# Altium schematic sheet GSM Module.SchDoc
size 209 x 297 mm; Author: Мурашкин Д.В.; Address1: Address1; Address2: Address2; Address3: Address3; Address4: Address4; DocumentNumber: АБВГ.123456.001 Э3; Scale: 1:1; Letter1Column: Э; PartName: GSM Модуль; DocumentName: 2
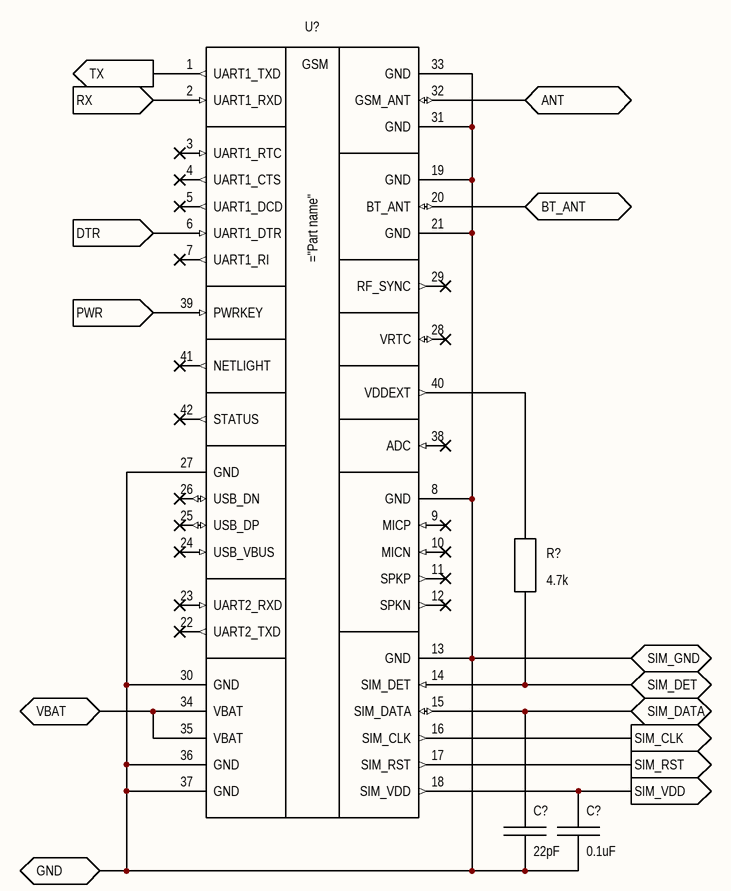
[diagram p0: GSM Module.SchDoc]

## Parts
(Parts that share a designator on the sheet are numbered #1, #2 ... from top to bottom, then left to right.)
C?#1  22pF  [CAPC1608L]
C?#2  0.1uF  [CAPC1608L]
R?  4.7k  [RESC1608L]
U?  (no value)  [SIM800C]

## Ports
ANT, BT_ANT, DTR (in), GND, PWR (in), RX (in), SIM_CLK (out), SIM_DATA (bidir), SIM_DET (bidir), SIM_GND, SIM_RST (out), SIM_VDD (out), TX (out), VBAT

## Nets
ANT: U?.32(GSM_ANT) ; port ANT
BT_ANT: U?.20(BT_ANT) ; port BT_ANT
DTR: U?.6(UART1_DTR) ; port DTR
GND: C?#1.2 C?#2.2 U?.8(GND) U?.13(GND) U?.19(GND) U?.21(GND) U?.27(GND) U?.30(GND) U?.31(GND) U?.33(GND) U?.36(GND) U?.37(GND) ; port SIM_GND, port GND
PWR: U?.39(PWRKEY) ; port PWR
RX: U?.2(UART1_RXD) ; port RX
SIM_CLK: U?.16(SIM_CLK) ; port SIM_CLK
SIM_DATA: C?#1.1 U?.15(SIM_DATA) ; port SIM_DATA
SIM_DET: R?.2 U?.14(SIM_DET) ; port SIM_DET
SIM_RST: U?.17(SIM_RST) ; port SIM_RST
SIM_VDD: C?#2.1 U?.18(SIM_VDD) ; port SIM_VDD
TX: U?.1(UART1_TXD) ; port TX
VBAT: U?.34(VBAT) U?.35(VBAT) ; port VBAT
NetR?_1: R?.1 U?.40(VDDEXT)

Not connected (* = marked no-connect by the designer): U? 3(UART1_RTC)* 4(UART1_CTS)* 5(UART1_DCD)* 7(UART1_RI)* 9(MICP)* 10(MICN)* 11(SPKP)* 12(SPKN)* 22(UART2_TXD)* 23(UART2_RXD)* 24(USB_VBUS)* 25(USB_DP)* 26(USB_DN)* 28(VRTC)* 29(RF_SYNC)* 38(ADC)* 41(NETLIGHT)* 42(STATUS)*

## Notes on the sheet
- Перв. примен.
- Справ. №
- Подп. и дата
- Инв. № дубл.
- Взам. инв. №
- Инв. № подл.
- Изм.
- Лист
- № докум.
- Подп.
- Дата
- 2.106-A4
- Копировал
- Формат А4
- (in symbol SIM800C) GSM

## Library data of the parts
C?#1 = CC0201JRNPO9BN220: Capacitor Ceramic 22pF 50V 0603(1608); Manufacturer: Yageo; Group: Ceramic Capacitors; Temperature Coefficient: C0G; Tolerance: ±5%; Voltage: 50; Type: Ceramic; Part name: CC0201JRNPO9BN220; Package: 0603 (1608); Value: 22pF
C?#2 = CC0603KRX7R8BB104: Capacitor Ceramic 0.1uF 25V 0603(1608); Manufacturer: Yageo; Group: Ceramic Capacitors; Temperature Coefficient: X7R; Tolerance: ±10%; Voltage: 25; Type: Ceramic; Part name: CC0603KRX7R8BB104; Package: 0603 (1608); Value: 0.1uF
R? = RC0603JR-074K7L: Resistor Ceramic 4.7k 0.1W 0603(1608); Manufacturer: Yageo; Group: Resistors; Temperature Coefficient: ±100ppm/°C; Tolerance: ±5%; Part name: RC0603JR-074K7L; Type: Thin Film; Power: 0.1W; Package: 0603 (1608); Value: 4.7k
U? = SIM800C: Quad-band GSM/GPRS module